# Altium project JC_Linearity_Board.PrjPcb
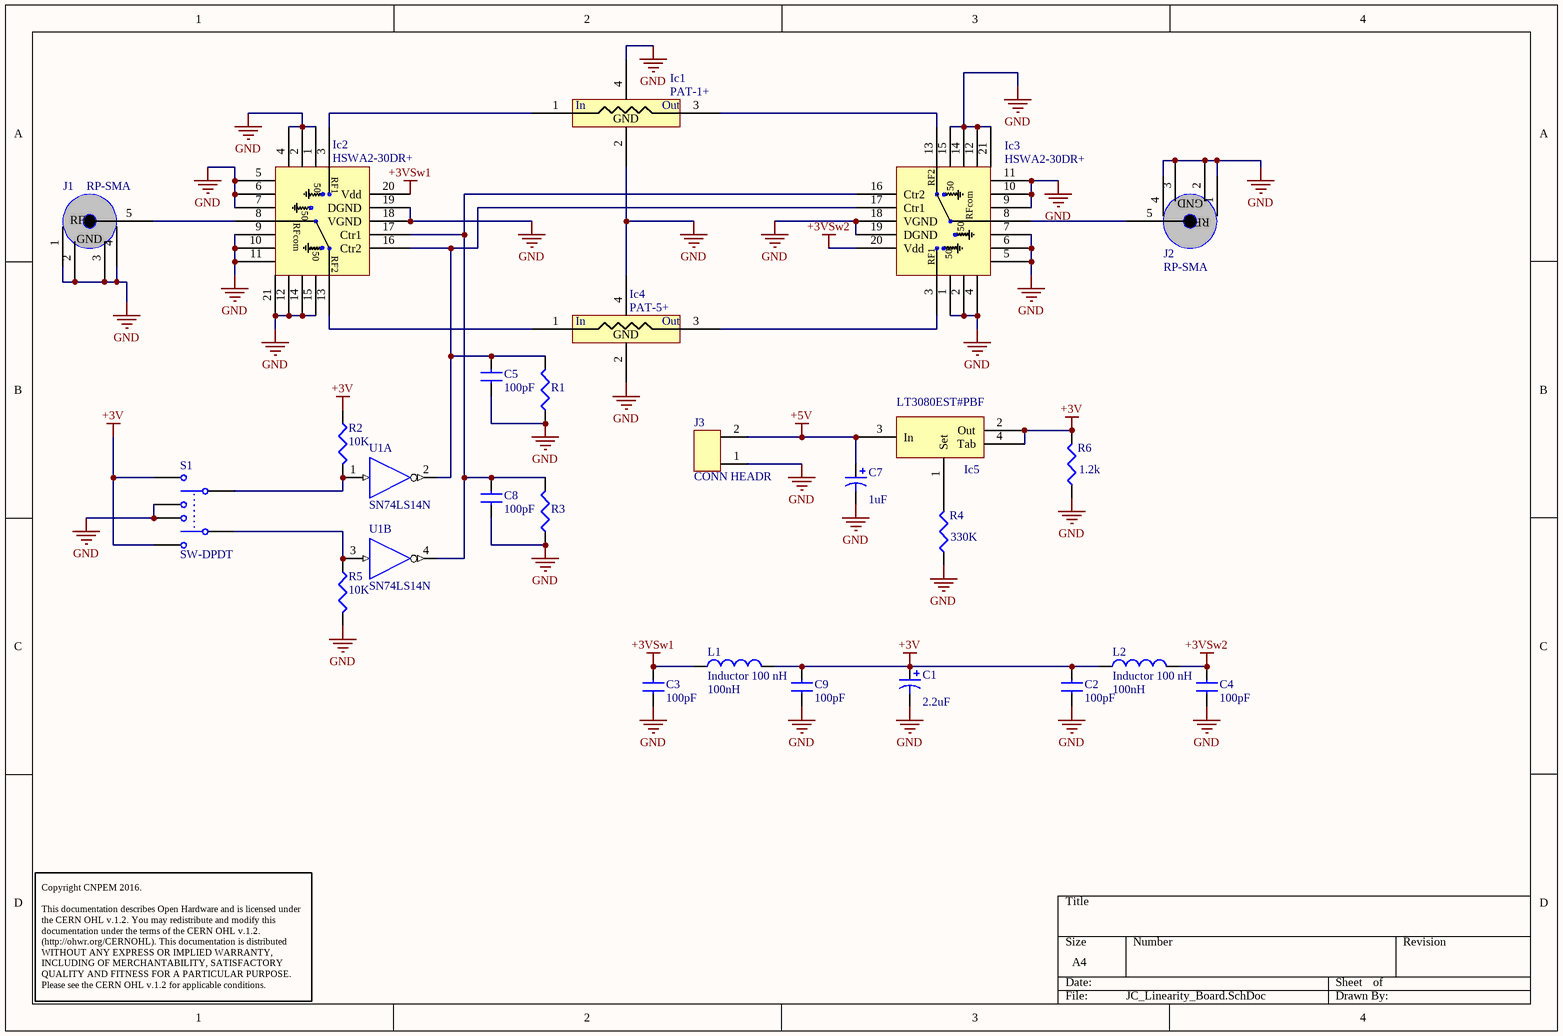
[diagram p0: JC_Linearity_Board.SchDoc]
1 sheet, 26 parts. Net scope: global (net labels, ports and power ports of the same name join across sheets).
Board file: JC_Linearity_Board.PcbDoc

## Sheet JC_Linearity_Board.SchDoc
size A4

### Parts
C1  value 2.2uF  [CAPC3225M]  (hidden comment: C1608Y5V1C225Z)
C2  Capacitance: 100pF  [CAPC1608N]  (hidden comment: C1608C0G1H101J)
C3  Capacitance: 100pF  [CAPC1608N]  (hidden comment: C1608C0G1H101J)
C4  Capacitance: 100pF  [CAPC1608N]  (hidden comment: C1608C0G1H101J)
C5  Capacitance: 100pF  [CAPC1608N]  (hidden comment: C1608C0G1H101J)
C7  value 1uF  [CAPC3225M]  (hidden comment: C1608Y5V1C225Z)
C8  Capacitance: 100pF  [CAPC1608N]  (hidden comment: C1608C0G1H101J)
C9  Capacitance: 100pF  [CAPC1608N]  (hidden comment: C1608C0G1H101J)
Ic1  PAT-1+  [AF320]
Ic2  HSWA2-30DR+  [DG983-1]
Ic3  HSWA2-30DR+  [DG983-1]
Ic4  PAT-5+  [AF320]
Ic5  LT3080EST#PBF  [SOT223-4L]
J1  Connector Style: RP-SMA  [SMAedge50R]  (hidden comment: CONN SMA)
J2  Connector Style: RP-SMA  [SMAedge50R]  (hidden comment: CONN SMA)
J3  CONN HEADR  [HDR1X2H]
L1  Inductor 100 nH  value 100nH  [CAPC1608M]
L2  Inductor 100 nH  value 100nH  [CAPC1608M]
R1  ERJ-3GEYJ103V  [RESC2012M]  (value not drawn)
R2  Resistance (Ohms): 10K  [RESC2012M]  (hidden comment: PNM0603E1002BST5)
R3  ERJ-3GEYJ103V  [RESC2012M]  (value not drawn)
R4  value 330K  [RESC2012M]  (hidden comment: ERJ-3GEYJ334V)
R5  Resistance (Ohms): 10K  [RESC2012M]  (hidden comment: PNM0603E1002BST5)
R6  value 1.2k  [RESC2012M]  (hidden comment: ERJ-3GEYJ122V)
S1  SW-DPDT  [DPDT-6]
U1  SN74LS14N  [646-06]  (parts A,B of 6)

### Nets
+3V: C1.1 C2.1 C9.1 Ic5.2(Out) Ic5.4(Tab) L1.2 L2.1 R2.2 R6.2 S1.2 S1.6
+3VSw1: C3.1 Ic2.20(Vdd) L1.1
+3VSw2: C4.1 Ic3.20(Vdd) L2.2
+5V: C7.1 Ic5.3(In) J3.2
GND: C1.2 C2.2 C3.2 C4.2 C5.2 C7.2 C8.2 C9.2 Ic1.2(GND) Ic1.4(GND) Ic2.1(GND) Ic2.2(GND) Ic2.4(GND) Ic2.5(GND) Ic2.6(GND) Ic2.7(GND) Ic2.9(GND) Ic2.10(GND) Ic2.11(GND) Ic2.12(GND) Ic2.14(GND) Ic2.15(GND) Ic2.18(VGND) Ic2.19(DGND) Ic2.21(GND) Ic3.1(GND) Ic3.2(GND) Ic3.4(GND) Ic3.5(GND) Ic3.6(GND) Ic3.7(GND) Ic3.9(GND) Ic3.10(GND) Ic3.11(GND) Ic3.12(GND) Ic3.14(GND) Ic3.15(GND) Ic3.18(VGND) Ic3.19(DGND) Ic3.21(GND) Ic4.2(GND) Ic4.4(GND) J1.1(GND) J1.2(GND) J1.3(GND) J1.4(GND) J2.1(GND) J2.2(GND) J2.3(GND) J2.4(GND) J3.1 R1.2 R3.2 R4.1 R5.1 R6.1 S1.3 S1.5 U1.7(GND)
VDD: U1.14(VDD)
NetC5_1: C5.1 Ic2.16(Ctr2) Ic3.17(Ctr1) R1.1 U1.2(~{OUT})
NetC8_1: C8.1 Ic2.17(Ctr1) Ic3.16(Ctr2) R3.1 U1.4(~{OUT})
NetIc1_1: Ic1.1(In) Ic2.3(RF1)
NetIc1_3: Ic1.3(Out) Ic3.13(RF2)
NetIc2_8: Ic2.8(RFcom) J1.5(RFin)
NetIc2_13: Ic2.13(RF2) Ic4.1(In)
NetIc3_3: Ic3.3(RF1) Ic4.3(Out)
NetIc3_8: Ic3.8(RFcom) J2.5(RFin)
NetIc5_1: Ic5.1(Set) R4.2
NetR2_1: R2.1 S1.4 U1.1(IN)
NetR5_2: R5.2 S1.1 U1.3(IN)

### Notes on the sheet
- Copyright CNPEM 2016.
  This documentation describes Open Hardware and is licensed under the CERN OHL v.1.2. You may redistribute and modify this documentation under the terms of the CERN OHL v.1.2. (http://ohwr.org/CERNOHL). This documentation is distributed WITHOUT ANY EXPRESS OR IMPLIED WARRANTY, INCLUDING OF MERCHANTABILITY, SATISFACTORY QUALITY AND FITNESS FOR A PARTICULAR PURPOSE. Please see the CERN OHL v.1.2 for applicable conditions.
- (in symbol 132289RP) RF
- (in symbol Minicircuits-HSWA2-30DR+) 50

### Library data of the parts
C1 = Cap Pol3: Polarized Capacitor (Surface Mount); Published: 8-Jun-2000; LatestRevisionDate: 29-May-2009; LatestRevisionNote: IPC-7351 Footprint Added.; PackageReference: C0805; Publisher: Altium Limited; PackageDescription: Chip Capacitor
C2-C5 C8 C9 = C1608C0G1H101J: CAP CER 100PF 50V 5% NP0 0603; Manufacturer: TDK Corporation; Temperature Coefficient: C0G, NP0; Supplier 1: Digi-Key; Manufacturer Part Number: C1608C0G1H101J; RoHS: RoHS Compliant; Category: Capacitors; Stock 1: 926382; Pricing 1: 1=0.09, 10=0.055, 100=0.0198, 250=0.01432, 500=0.01056, 1000=0.00715 (USD); Voltage - Rated: 50V; Tolerance: ±5%; Mounting Type: Surface Mount, MLCC; Operating Temperature: -55°C ~ 125°C; Applications: General Purpose; Ratings: -; Package / Case: 0603 (1608 Metric); Size / Dimension: 0.063" L x 0.031" W (1.60mm x 0.80mm); Height - Seated (Max): -; Thickness (Max): 0.037" (0.95mm); Lead Spacing: -; Features: -; Packaging: Cut Tape (CT); Lead Style: -; ComponentLink1URL: http://www.tdk.com/pdf/general_B11.pdf; ComponentLink1Description: http://www.tdk.com/pdf/general_B11.pdf; Supplier Part Number 1: 445-1281-1-ND
C7 = Cap Pol3: 'CAP CER 100PF 50V 5% NP0 0603; Published: 8-Jun-2000; LatestRevisionDate: 29-May-2009; LatestRevisionNote: IPC-7351 Footprint Added.; PackageReference: C0805; Publisher: Altium Limited; PackageDescription: Chip Capacitor
Ic1 = Minicircuits-PAT-1+: Fixed Attenuator 1 dB; ComponentLink1Description: http://www.minicircuits.com/pdfs/PAT-1+.pdf; Manufacturer: Minicircuits; Manufacturer Part Number: PAT-1+; ComponentLink1URL: http://www.minicircuits.com/pdfs/PAT-1+.pdf
Ic2 Ic3 = Minicircuits-HSWA2-30DR+: Absoptive RF Switch SPDT; ComponentLink1Description: http://www.minicircuits.com/pdfs/HSWA2-30DR+.pdf; Manufacturer: Minicircuits; Manufacturer Part Number: HSWA2-30DR+; ComponentLink1URL: http://www.minicircuits.com/pdfs/HSWA2-30DR+.pdf
Ic4 = Minicircuits-PAT-3+: Fixed Attenuator 3 dB; Manufacturer Part Number: PAT-3+; ComponentLink1Description: http://www.minicircuits.com/pdfs/PAT-3+.pdf; Manufacturer: Minicircuits; ComponentLink1URL: http://www.minicircuits.com/pdfs/PAT-3+.pdf
Ic5 = LT3080EST#PBF: IC REG LDO 1.1A ADJ SOT223-3; Manufacturer: Linear Technology; Regulator Topology: Positive Adjustable; Voltage - Output: Adj to 36V; Voltage - Input: 1.2 V ~ 36 V; Voltage - Dropout (Typical): 1.35V @ 1.1A; Number of Regulators: 1; Supplier 1: Digi-Key; Manufacturer Part Number: LT3080EST#PBF; RoHS: RoHS Compliant; Category: Integrated Circuits (ICs); Stock 1: 5522; Pricing 1: 1=3.64, 25=2.59, 100=2.2 (USD); Current - Output: 1.1A; Current - Limit (Min): 1.1A; Operating Temperature: -40°C ~ 125°C; Mounting Type: Surface Mount; Package / Case: TO-261-4, TO-261AA; Supplier Device Package: SOT-223; Packaging: Tube; ComponentLink1URL: http://www.linear.com/docs/25276; ComponentLink1Description: http://www.linear.com/docs/25276
J1 J2 = 132289RP: CONN RCPT BLKHD SMA REV POL PCB; Manufacturer: Amphenol Connex; Connector Type: Jack, Male Pins; Contact Termination: Solder; Impedance: 50 Ohm; Frequency - Max: 18GHz; Supplier 1: Digi-Key; Manufacturer Part Number: 132289RP; RoHS: RoHS Compliant; Category: Connectors, Interconnects; Stock 1: 65; Pricing 1: 1=10.8, 10=9.99, 100=8.37, 250=7.29, 500=7.02, 1000=6.75 (USD); Mounting Type: Board Edge, End Launch; Fastening Type: Threaded; Cable Group: -; Features: -; Color: -; Packaging: Bulk; ComponentLink1URL: http://www.amphenolconnex.com/media/downloads/4145/132289rp.pdf; ComponentLink1Description: http://www.amphenolconnex.com/media/downloads/4145/132289rp.pdf; Supplier Part Number 1: ACX1427-ND
J3 = 4-103321-4: CONN HEADR BRKWAY .100 2POS STR; Manufacturer: TE Connectivity; Connector Type: Header, Unshrouded, Breakaway; Number of Positions: 2; Number of Positions Loaded: All; Pitch: 0.100" (2.54mm); Supplier 1: Digi-Key; Manufacturer Part Number: 4-103321-4; RoHS: RoHS non-compliant; Category: Connectors, Interconnects; Stock 1: 0; Pricing 1: 20000=0.07434 (USD); Contact Type: Male Pin; Number of Rows: 1; Row Spacing: -; Contact Mating Length: 0.318" (8.08mm); Mounting Type: Through Hole; Termination: Solder; Fastening Type: -; Features: -; Contact Finish: Tin; Contact Finish Thickness: 100µin (2.54µm); Color: Black; Packaging: Bulk; ComponentLink1URL: http://documents.tycoelectronics.com/commerce/DocumentDelivery/DDEController?Action=srchrtrv&DocNm=103321&DocType=CD&DocLang=EN; ComponentLink1Description: http://documents.tycoelectronics.com/commerce/DocumentDelivery/DDEController?Action=srchrtrv&DocNm=103321&DocType=CD&DocLang=EN; Supplier Part Number 1: 4-103321-4-ND
L1 L2 = Inductor: Code_IEC: 1005; Published: 8-Jun-2000; LatestRevisionDate: 29-May-2009; LatestRevisionNote: IPC-7351 Footprint Added.; PackageReference: 0402-A; Publisher: Altium Limited; PackageDescription: Chip Inductor; Code_JEITA: 0402
R1 R3 = ERJ-3GEYJ103V: RES 10K OHM 1/10W 5% 0603 SMD; Manufacturer: Panasonic - ECG; Power (Watts): 0.1W, 1/10W; Temperature Coefficient: ±200ppm/°C; Supplier 1: Digi-Key; Manufacturer Part Number: ERJ-3GEYJ103V; RoHS: RoHS Compliant; Category: Resistors; Stock 1: 13981989; Pricing 1: 1=0.1, 50=0.0092, 100=0.007, 250=0.0052, 500=0.00384, 1000=0.00256 (USD); Composition: Thick Film; Features: -; Tolerance: ±5%; Package / Case: 0603 (1608 Metric); Size / Dimension: 0.063" L x 0.031" W (1.60mm x 0.80mm); Height: 0.022" (0.55mm); Number of Terminations: 2; Packaging: Cut Tape (CT); ComponentLink1URL: http://industrial.panasonic.com/www-cgi/jvcr13pz.cgi?E+PZ+3+AOA0001+ERJ3GEYJ103V+7+WW; ComponentLink1Description: http://industrial.panasonic.com/www-cgi/jvcr13pz.cgi?E+PZ+3+AOA0001+ERJ3GEYJ103V+7+WW; Supplier Part Number 1: P10KGCT-ND; Resistance (Ohms): 10K
R2 R5 = PNM0603E1002BST5: RES 10K OHM .15W 0.1% 0603 SMD; Manufacturer: Vishay Thin Film; Power (Watts): 0.15W; Temperature Coefficient: ±25ppm/°C; Supplier 1: Digi-Key; Manufacturer Part Number: PNM0603E1002BST5; RoHS: RoHS Compliant; Category: Resistors; Stock 1: 780; Pricing 1: 1=3.42, 25=2.85, 100=2.47, 250=2.185 (USD); Composition: Thin Film; Features: Moisture Resistant, Non-Inductive, Non-Magnetic; Tolerance: ±0.1%; Package / Case: 0603 (1608 Metric); Size / Dimension: 0.064" L x 0.032" W (1.63mm x 0.81mm); Height: 0.020" (0.51mm); Number of Terminations: 2; Packaging: Cut Tape (CT); ComponentLink1URL: http://www.vishay.com/docs/60057/pnm.pdf; ComponentLink1Description: http://www.vishay.com/docs/60057/pnm.pdf; Supplier Part Number 1: PNM0603-10KBCT-ND
R4 = Res3: RES 330K OHM 1/10W 5% 0603 SMD; Published: 8-Jun-2000; LatestRevisionDate: 29-May-2009; LatestRevisionNote: IPC-7351 Footprint Added.; PackageReference: J1-0603; Publisher: Altium Limited; PackageDescription: Chip Resistor
R6 = Res3: RES 1K2 OHM 1/10W 5% 0603 SMD; Published: 8-Jun-2000; LatestRevisionDate: 29-May-2009; LatestRevisionNote: IPC-7351 Footprint Added.; PackageReference: J1-0603; Publisher: Altium Limited; PackageDescription: Chip Resistor
S1 = SW-DPDT: Double-Pole, Double-Throw Switch; Published: 24-Mar-1999; LatestRevisionDate: 17-Jul-2002; LatestRevisionNote: Re-released for DXP Platform.; PackageReference: DPDT-6; Publisher: Altium Limited; PackageDescription: Switch; 6 Leads
U1 = SN74LS14N: Hex Schmitt-Trigger Inverter; Published: 15-Apr-2002; DatasheetVersion: 18-Oct-1996; PackageVersion: 1995; PackageReference: 646-06; Publisher: Altium Limited; PackageDescription: DIP; 14 Leads; Row Spacing 7.62 mm; Pitch 2.54 mm; ComponentLink1Description: Manufacturer Link; ComponentLink1URL: http://www.onsemi.com/; ComponentLink2Description: Datasheet; ComponentLink2URL: http://www.onsemi.com/pub/Collateral/SN74LS14-D.PDF